# Altium schematic sheet 01-Header.SchDoc: Header
size A3; CheckedBy: Oleksandr Skurlov; CompanyName: X2E GmbH; Engineer: Nader Aribi; Revision: 0.00; SheetNumber: 1; SheetTotal: 10; Version: 1.00; Address: Jahnstr. 2b 76870 Kandel; PageSetup: Record=PageOptions|CenterHorizontal=True|CenterVertical=True|PrintScale=1.01|XCorrection=1.00|YCorrection=1.00|PrintKind=0|BorderSize=5000000|LeftOffset=0|BottomOffset=0|Orientation=2|PaperLength=1000|PaperWidth=1000|Scale=100|PaperSource=15|PrintQuality=600|MediaType=1|DitherType=10|PrintScaleMode=1|PaperKind=A3
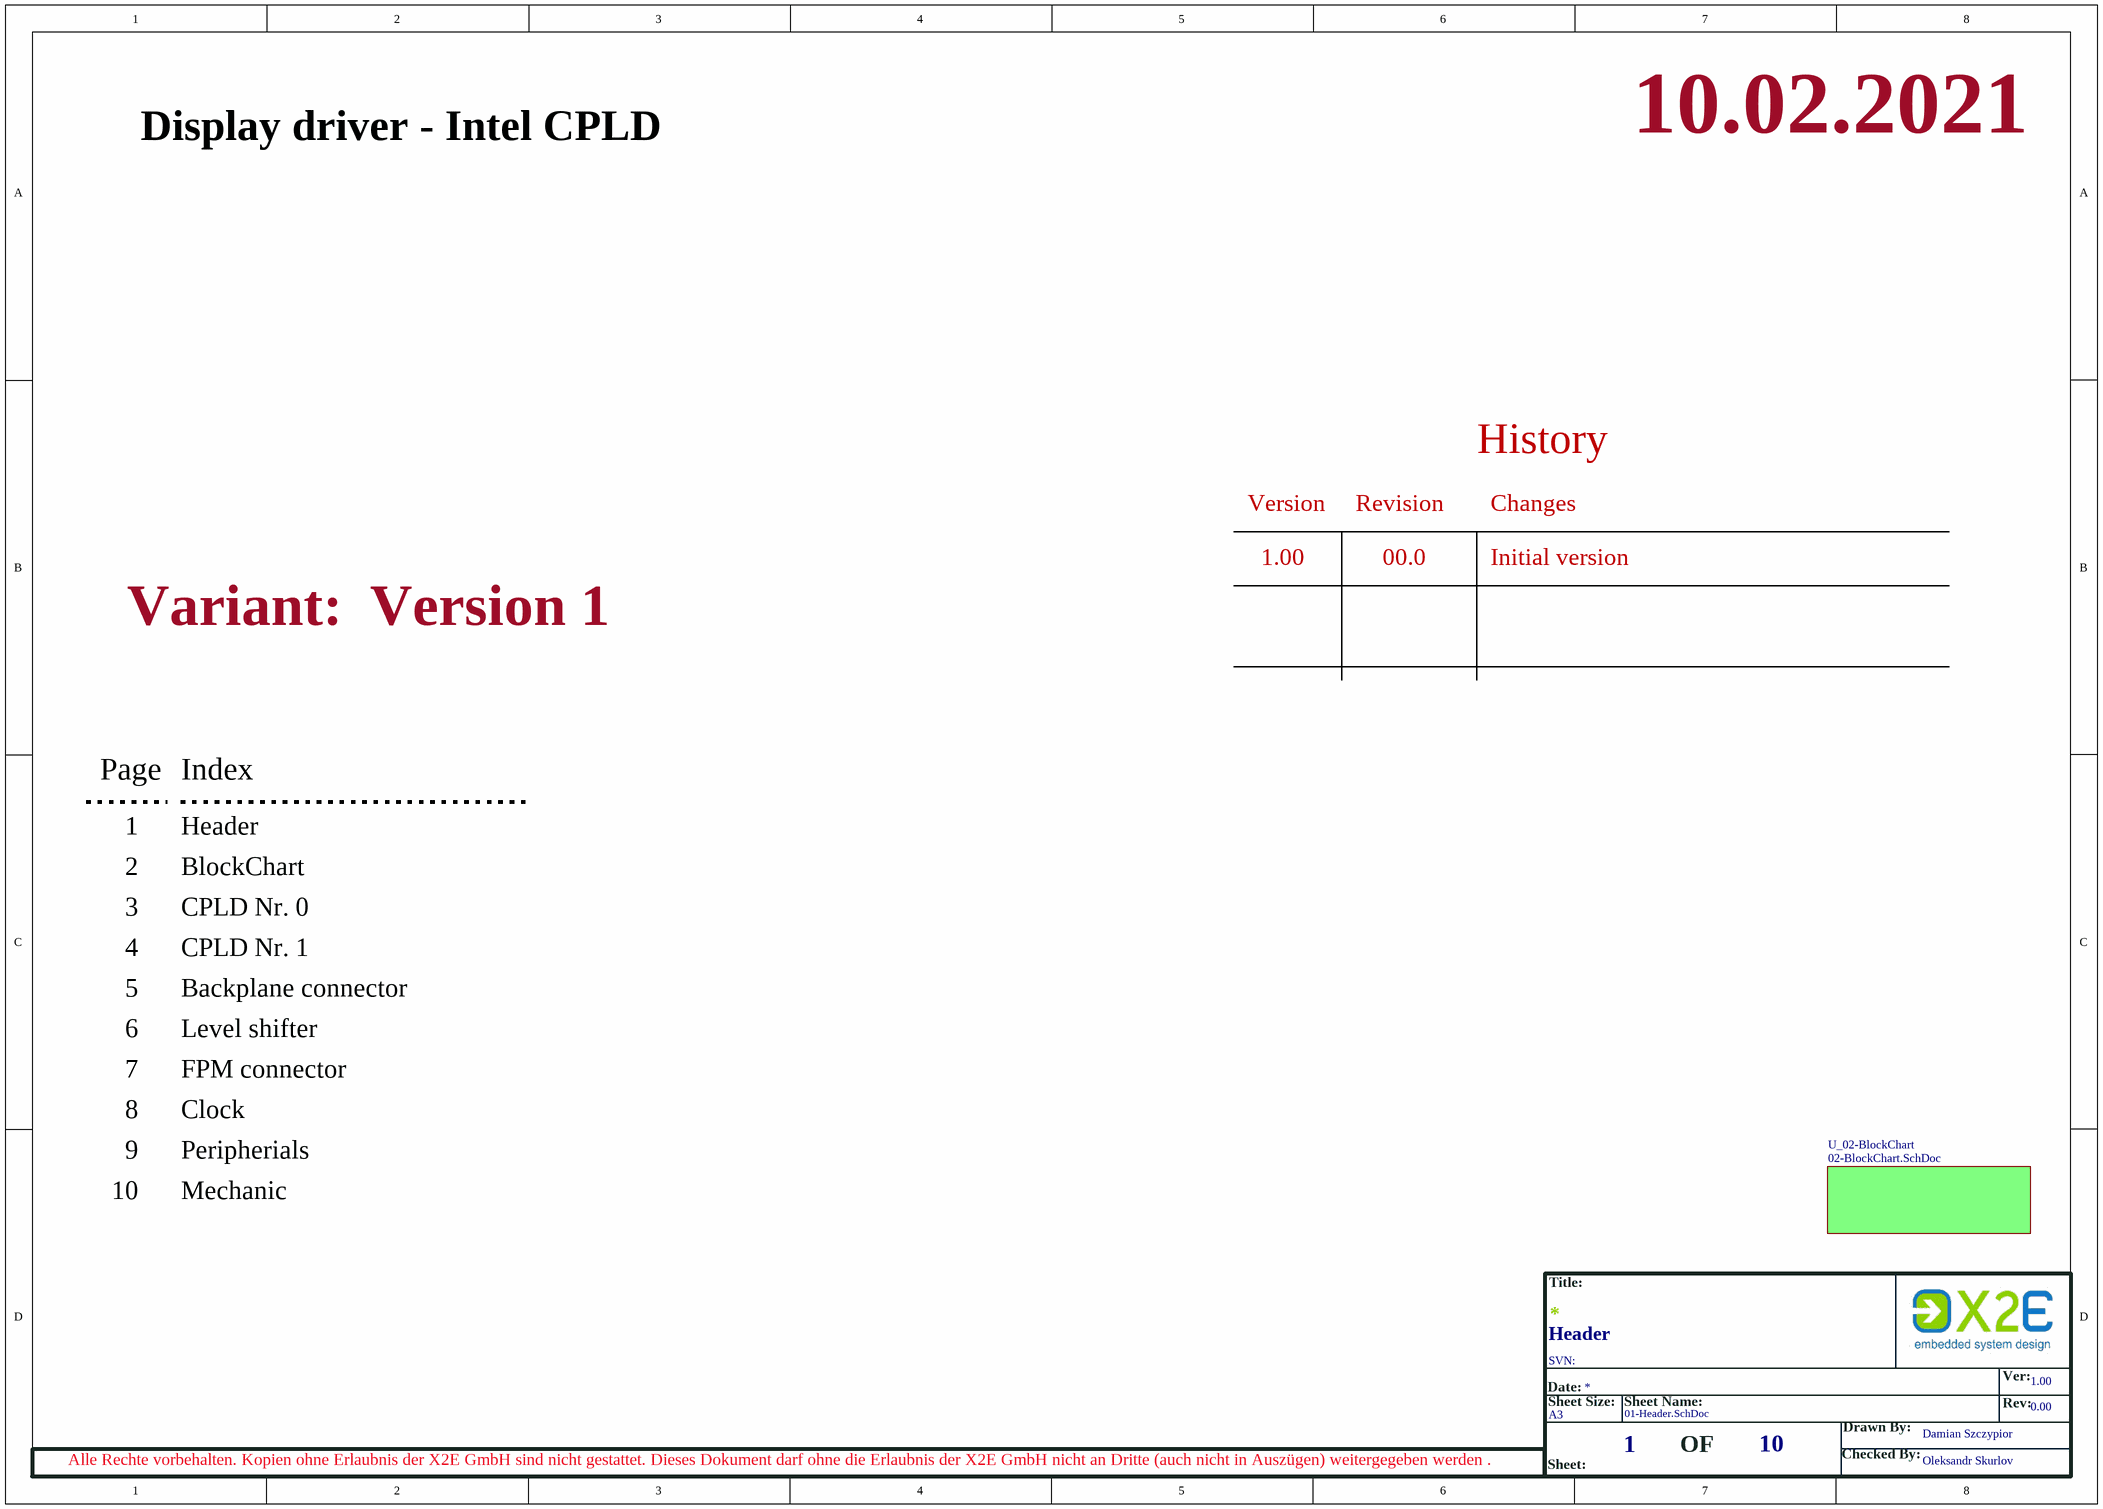
[diagram p0: 01-Header.SchDoc]

## Sub-sheets
U_02-BlockChart = 02-BlockChart.SchDoc: no entries

## Notes on the sheet
- 10.02.2021
- Display driver - Intel CPLD
- Version
- Revision
- History
- Changes
- 1.00
- 00.0
- Initial version
- Variant:
- Version 1
- Page
- Index
- 1
- Header
- 2
- 3
- BlockChart
- CPLD Nr. 0
- 4
- CPLD Nr. 1
- 5
- 6
- Backplane connector
- Level shifter
- 7
- 8
- FPM connector
- Clock
- 9
- Peripherials
- 10
- Mechanic
- Title:
- Date:
- SVN:
- Ver:
- Sheet Size:
- A3
- Sheet Name:
- OF
- Checked By:
- Drawn By:
- Damian Szczypior
- Rev:
- Alle Rechte vorbehalten. Kopien ohne Erlaubnis der X2E GmbH sind nicht gestattet. Dieses Dokument darf ohne die Erlaubnis der X2E GmbH nicht an Dritte (auch nicht in Auszügen) weitergegeben werden .
- Sheet: